# Altium schematic sheet LEDS.SchDoc
size A4; SheetNumber: 9; SheetTotal: 11
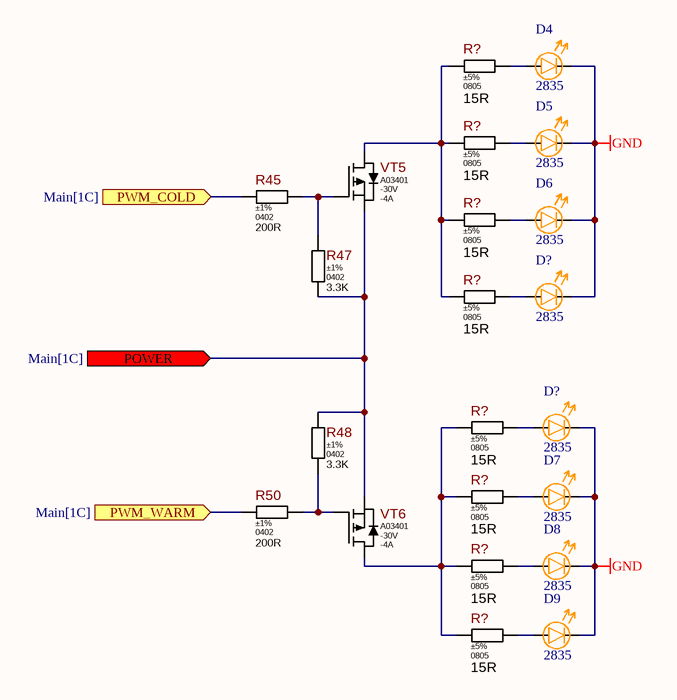
[diagram p0: LEDS.SchDoc]

## Parts
(Parts that share a designator on the sheet are numbered #1, #2 ... from top to bottom, then left to right.)
D4  2835  [2835 LED]
D5  2835  [2835 LED]
D6  2835  [2835 LED]
D7  2835  [2835 LED]
D8  2835  [2835 LED]
D9  2835  [2835 LED]
D?#1  2835  [2835 LED]
D?#2  2835  [2835 LED]
R45  value 200R  Tolerance: ±1%  Package: 0402  [Res_0402]  (hidden comment: Res_0402_200R)
R47  value 3.3K  Tolerance: ±1%  Package: 0402  [Res_0402]  (hidden comment: Res_0402_3.3K)
R48  value 3.3K  Tolerance: ±1%  Package: 0402  [Res_0402]  (hidden comment: Res_0402_3.3K)
R50  value 200R  Tolerance: ±1%  Package: 0402  [Res_0402]  (hidden comment: Res_0402_200R)
R?#1  value 15R  Tolerance: ±5%  Package: 0805  [Res_0805]  (hidden comment: Res_0805_15R)
R?#2  value 15R  Tolerance: ±5%  Package: 0805  [Res_0805]  (hidden comment: Res_0805_15R)
R?#3  value 15R  Tolerance: ±5%  Package: 0805  [Res_0805]  (hidden comment: Res_0805_15R)
R?#4  value 15R  Tolerance: ±5%  Package: 0805  [Res_0805]  (hidden comment: Res_0805_15R)
R?#5  value 15R  Tolerance: ±5%  Package: 0805  [Res_0805]  (hidden comment: Res_0805_15R)
R?#6  value 15R  Tolerance: ±5%  Package: 0805  [Res_0805]  (hidden comment: Res_0805_15R)
R?#7  value 15R  Tolerance: ±5%  Package: 0805  [Res_0805]  (hidden comment: Res_0805_15R)
R?#8  value 15R  Tolerance: ±5%  Package: 0805  [Res_0805]  (hidden comment: Res_0805_15R)
VT5  Vds: -30V  Id: -4A  [SOT-23]  (hidden comment: A03401)
VT6  Vds: -30V  Id: -4A  [SOT-23]  (hidden comment: A03401)

## Ports
POWER (in, see Main[1C]), PWM_COLD (in, see Main[1C]), PWM_WARM (in, see Main[1C])

## Nets
GND: D4.1(C) D5.1(C) D6.1(C) D7.1(C) D8.1(C) D9.1(C) D?#1.1(C) D?#2.1(C)
POWER: R47.2 R48.1 VT5.2(S) VT6.2(S) ; port POWER
PWM_COLD: R45.1 ; port PWM_COLD
PWM_WARM: R50.1 ; port PWM_WARM
NetD4_2: D4.2(A) R?#1.2
NetD5_2: D5.2(A) R?#2.2
NetD6_2: D6.2(A) R?#3.2
NetD7_2: D7.2(A) R?#6.2
NetD8_2: D8.2(A) R?#7.2
NetD9_2: D9.2(A) R?#8.2
NetD?#1_2: D?#1.2(A) R?#4.2
NetD?#2_2: D?#2.2(A) R?#5.2
NetR45_2: R45.2 R47.1 VT5.1(G)
NetR48_2: R48.2 R50.2 VT6.1(G)
NetR?#1_1: R?#1.1 R?#2.1 R?#3.1 R?#4.1 VT5.3(D)
NetR?#5_1: R?#5.1 R?#6.1 R?#7.1 R?#8.1 VT6.3(D)

## Library data of the parts
D4-D9 D?#1 D?#2 = 2835 Led: 2835 Led 2.85v 150mA
R45 R50 = Res_0402_200R: ±1% 1/16W 0402; Power Rating: 0.062W; Voltage: 50V; ComponentLink1URL: https://www.yageo.com/upload/media/product/productsearch/datasheet/rchip/PYu-RC_Group_51_RoHS_L_10.pdf; ComponentLink1Description: Datasheet
R47 R48 = Res_0402_3.3K: ±1% 1/16W 0402; Power Rating: 0.062W; Voltage: 50V; ComponentLink1URL: https://www.yageo.com/upload/media/product/productsearch/datasheet/rchip/PYu-RC_Group_51_RoHS_L_10.pdf; ComponentLink1Description: Datasheet
R?#1-R?#8 = Res_0805_15R: ±5% 1/8W 0805; Power Rating: 0.062W; Voltage: 50V; ComponentLink1URL: https://www.yageo.com/upload/media/product/productsearch/datasheet/rchip/PYu-RC_Group_51_RoHS_L_10.pdf; ComponentLink1Description: Datasheet
VT5 VT6 = A03401: -30V, -4A max P-Channel  MOSFET, 60mOhm @ Vgs = -4.5V; Part Type: N-Channel; Component Type: SMD; ComponentLink1URL: https://datasheetspdf.com/pdf-file/767558/Alpha&OmegaSemiconductors/AO3416/1; ComponentLink1Description: Datasheet; Package: SOT-23; Rds: 60mOhm; Name: A03401